# EAGLE design Master (EAGLE 9.5.0)
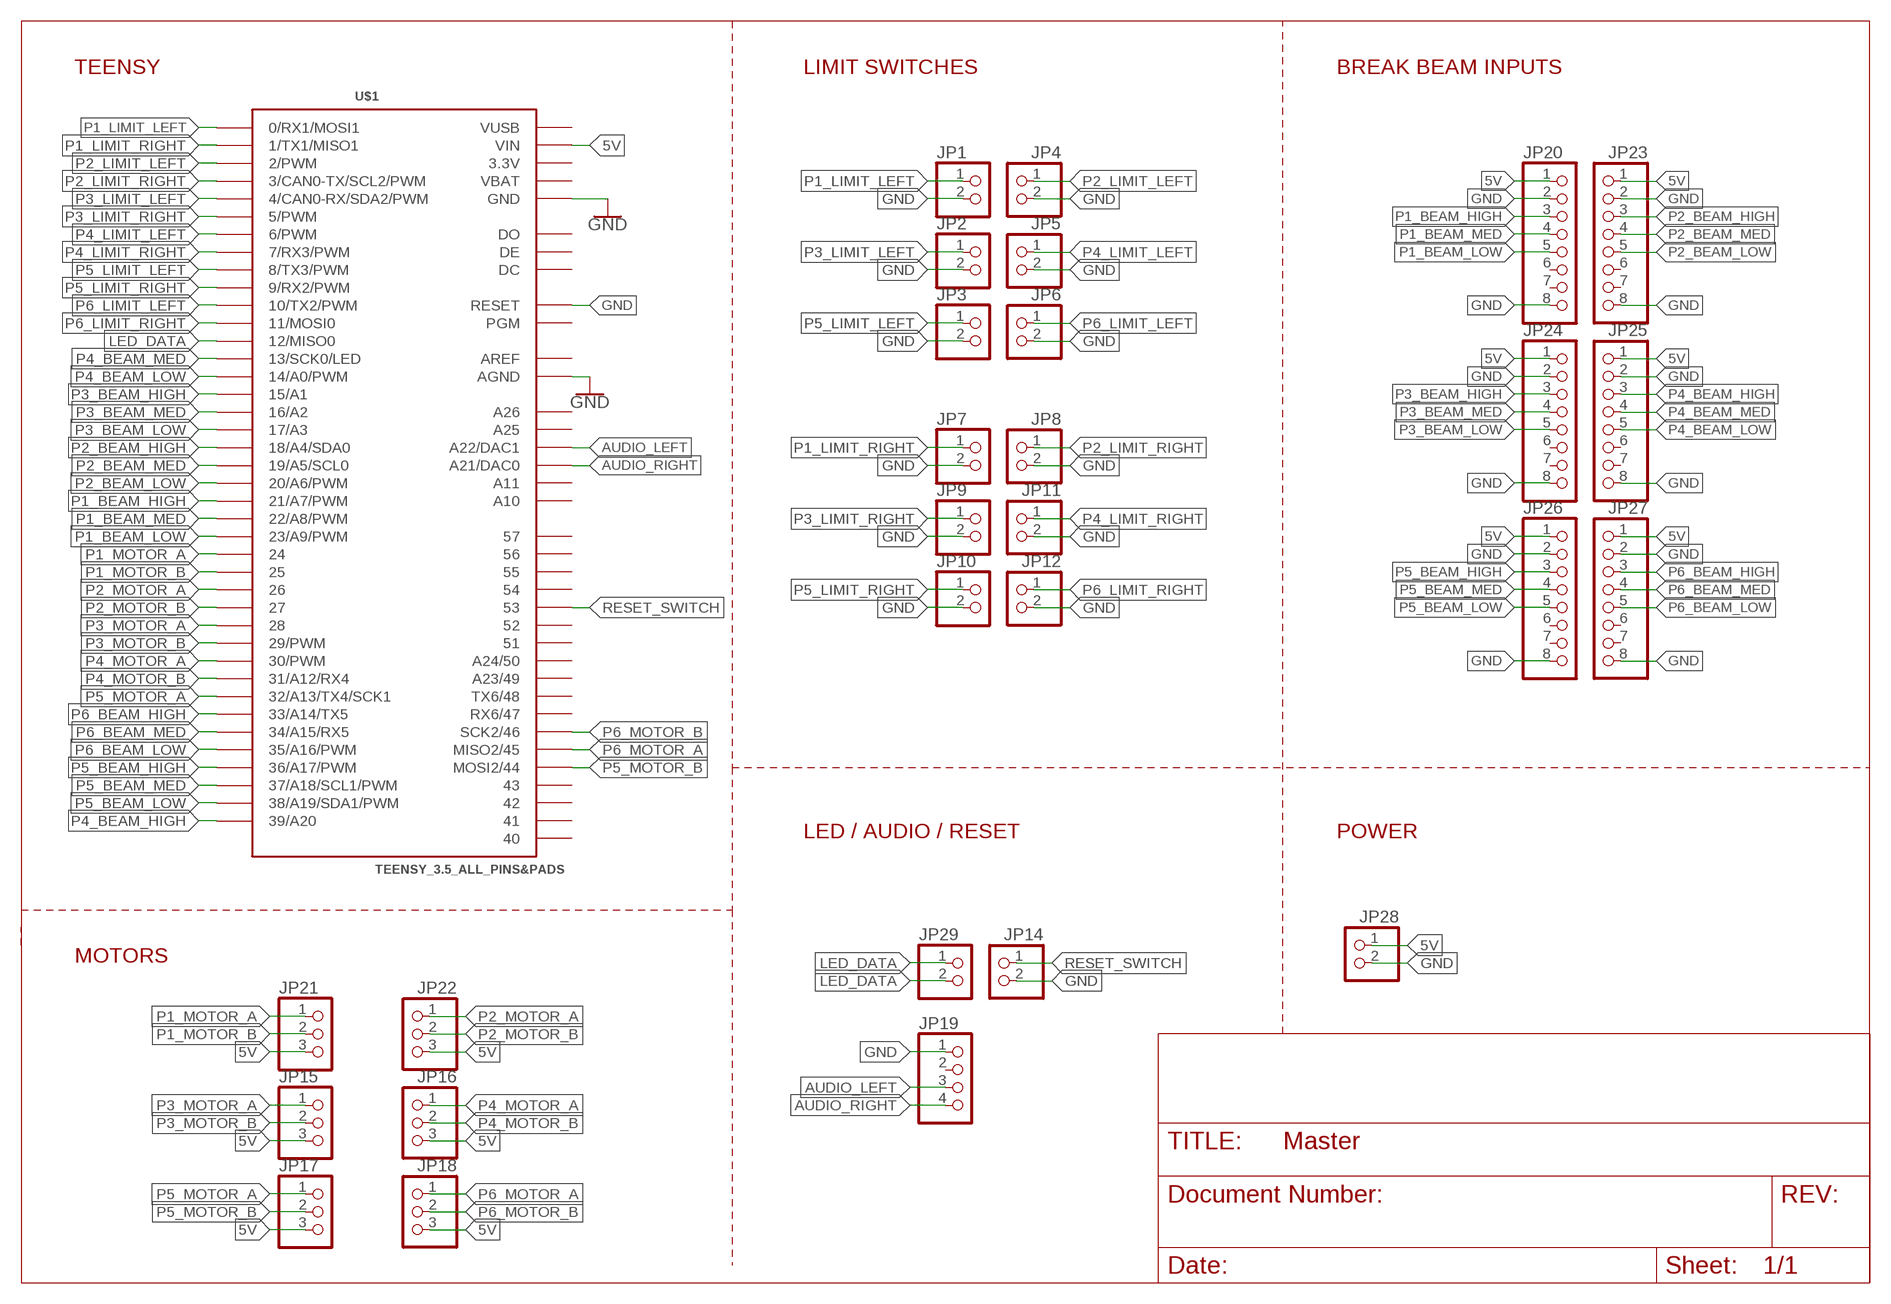
[diagram p0: schematic, sheet 1]

## Parts
JP1  PINHD-1X2  [1X02]
JP2  PINHD-1X2  [1X02]
JP3  PINHD-1X2  [1X02]
JP4  PINHD-1X2  [1X02]
JP5  PINHD-1X2  [1X02]
JP6  PINHD-1X2  [1X02]
JP7  PINHD-1X2  [1X02]
JP8  PINHD-1X2  [1X02]
JP9  PINHD-1X2  [1X02]
JP10  PINHD-1X2  [1X02]
JP11  PINHD-1X2  [1X02]
JP12  PINHD-1X2  [1X02]
JP14  PINHD-1X2  [1X02]
JP15  PINHD-1X3  [1X03]
JP16  PINHD-1X3  [1X03]
JP17  PINHD-1X3  [1X03]
JP18  PINHD-1X3  [1X03]
JP19  PINHD-1X4  [1X04]
JP20  PINHD-1X8  [1X08]
JP21  PINHD-1X3  [1X03]
JP22  PINHD-1X3  [1X03]
JP23  PINHD-1X8  [1X08]
JP24  PINHD-1X8  [1X08]
JP25  PINHD-1X8  [1X08]
JP26  PINHD-1X8  [1X08]
JP27  PINHD-1X8  [1X08]
JP28  PINHD-1X2  [1X02]
JP29  PINHD-1X2  [1X02]
U$1  TEENSY_3.5_ALL_PINS&PADS  [TEENSY_3.5_ALL_PINS&PADS]

## Nets
5V: JP15.3 JP16.3 JP17.3 JP18.3 JP20.1 JP21.3 JP22.3 JP23.1 JP24.1 JP25.1 JP26.1 JP27.1 JP28.1 U$1.VIN
AUDIO_LEFT: JP19.3 U$1.A22(A22/DAC1)
AUDIO_RIGHT: JP19.4 U$1.A21(A21/DAC0)
GND: JP1.2 JP2.2 JP3.2 JP4.2 JP5.2 JP6.2 JP7.2 JP8.2 JP9.2 JP10.2 JP11.2 JP12.2 JP14.2 JP19.1 JP20.2 JP20.8 JP23.2 JP23.8 JP24.2 JP24.8 JP25.2 JP25.8 JP26.2 JP26.8 JP27.2 JP27.8 JP28.2 U$1.AGND U$1.GND U$1.GND1(GND) U$1.GND2(GND) U$1.GND3(GND) U$1.GND4(GND) U$1.GND5(GND) U$1.GND6(GND) U$1.RESET
LED_DATA: JP29.1 JP29.2 U$1.12(12/MISO0)
P1_BEAM_HIGH: JP20.3 U$1.21/A7(21/A7/PWM)
P1_BEAM_LOW: JP20.5 U$1.23/A9(23/A9/PWM)
P1_BEAM_MED: JP20.4 U$1.22/A8(22/A8/PWM)
P1_LIMIT_LEFT: JP1.1 U$1.0(0/RX1/MOSI1)
P1_LIMIT_RIGHT: JP7.1 U$1.1(1/TX1/MISO1)
P1_MOTOR_A: JP21.1 U$1.24
P1_MOTOR_B: JP21.2 U$1.25
P2_BEAM_HIGH: JP23.3 U$1.18/A4(18/A4/SDA0)
P2_BEAM_LOW: JP23.5 U$1.20/A6(20/A6/PWM)
P2_BEAM_MED: JP23.4 U$1.19/A5(19/A5/SCL0)
P2_LIMIT_LEFT: JP4.1 U$1.2(2/PWM)
P2_LIMIT_RIGHT: JP8.1 U$1.3(3/CAN0-TX/SCL2/PWM)
P2_MOTOR_A: JP22.1 U$1.26
P2_MOTOR_B: JP22.2 U$1.27
P3_BEAM_HIGH: JP24.3 U$1.15/A1
P3_BEAM_LOW: JP24.5 U$1.17/A3
P3_BEAM_MED: JP24.4 U$1.16/A2
P3_LIMIT_LEFT: JP2.1 U$1.4(4/CAN0-RX/SDA2/PWM)
P3_LIMIT_RIGHT: JP9.1 U$1.5(5/PWM)
P3_MOTOR_A: JP15.1 U$1.28
P3_MOTOR_B: JP15.2 U$1.29(29/PWM)
P4_BEAM_HIGH: JP25.3 U$1.39/A20
P4_BEAM_LOW: JP25.5 U$1.14/A0(14/A0/PWM)
P4_BEAM_MED: JP25.4 U$1.13(13/SCK0/LED)
P4_LIMIT_LEFT: JP5.1 U$1.6(6/PWM)
P4_LIMIT_RIGHT: JP11.1 U$1.7(7/RX3/PWM)
P4_MOTOR_A: JP16.1 U$1.30(30/PWM)
P4_MOTOR_B: JP16.2 U$1.31/A12(31/A12/RX4)
P5_BEAM_HIGH: JP26.3 U$1.36/A17(36/A17/PWM)
P5_BEAM_LOW: JP26.5 U$1.38/A19(38/A19/SDA1/PWM)
P5_BEAM_MED: JP26.4 U$1.37/A18(37/A18/SCL1/PWM)
P5_LIMIT_LEFT: JP3.1 U$1.8(8/TX3/PWM)
P5_LIMIT_RIGHT: JP10.1 U$1.9(9/RX2/PWM)
P5_MOTOR_A: JP17.1 U$1.32/A13(32/A13/TX4/SCK1)
P5_MOTOR_B: JP17.2 U$1.44(MOSI2/44)
P6_BEAM_HIGH: JP27.3 U$1.33/A14(33/A14/TX5)
P6_BEAM_LOW: JP27.5 U$1.35/A16(35/A16/PWM)
P6_BEAM_MED: JP27.4 U$1.34/A15(34/A15/RX5)
P6_LIMIT_LEFT: JP6.1 U$1.10(10/TX2/PWM)
P6_LIMIT_RIGHT: JP12.1 U$1.11(11/MOSI0)
P6_MOTOR_A: JP18.1 U$1.45(MISO2/45)
P6_MOTOR_B: JP18.2 U$1.46(SCK2/46)
RESET_SWITCH: JP14.1 U$1.53
Unconnected: JP19.2 JP20.6 JP20.7 JP23.6 JP23.7 JP24.6 JP24.7 JP25.6 JP25.7 JP26.6 JP26.7 JP27.6 JP27.7 U$1.40 U$1.41 U$1.42 U$1.43 U$1.47(RX6/47) U$1.48(TX6/48) U$1.49(A23/49) U$1.50(A24/50) U$1.51 U$1.52 U$1.54 U$1.55 U$1.56 U$1.57 U$1.A10 U$1.A11 U$1.A25 U$1.A26 U$1.DC U$1.DE U$1.DO U$1.PGM

## Notes on the sheet
- TEENSY | LIMIT SWITCHES | BREAK BEAM INPUTS
- LED / AUDIO / RESET | POWER
- MOTORS

## Power pins joined to a net without a drawn wire
3.3V: U$1.3.3V U$1.3.3V2(3.3V) U$1.3.3V3(3.3V) U$1.3.3V4(3.3V)
AREF: U$1.AREF
VBAT: U$1.VBAT
VUSB: U$1.VUSB

## Library data of the parts
JP1-JP12 JP14 JP28 JP29 = pinhead:PINHD-1X2: PIN HEADER
JP15-JP18 JP21 JP22 = pinhead:PINHD-1X3: PIN HEADER
JP19 = pinhead:PINHD-1X4: PIN HEADER
JP20 JP23-JP27 = pinhead:PINHD-1X8: PIN HEADER
U$1 = Teensy_3_and_LC_Series_Boards_v1.4:TEENSY_3.5_ALL_PINS&PADS: All pins and pads on the Teensy 3.5 exposed. Assumes the use of multiple, unshrouded headers to get access to the pads on the underside of the Teensy These headers should be a 2x5, 2x4, and a 2x3 with a 0.1" hole spacing / pitch.

## Board
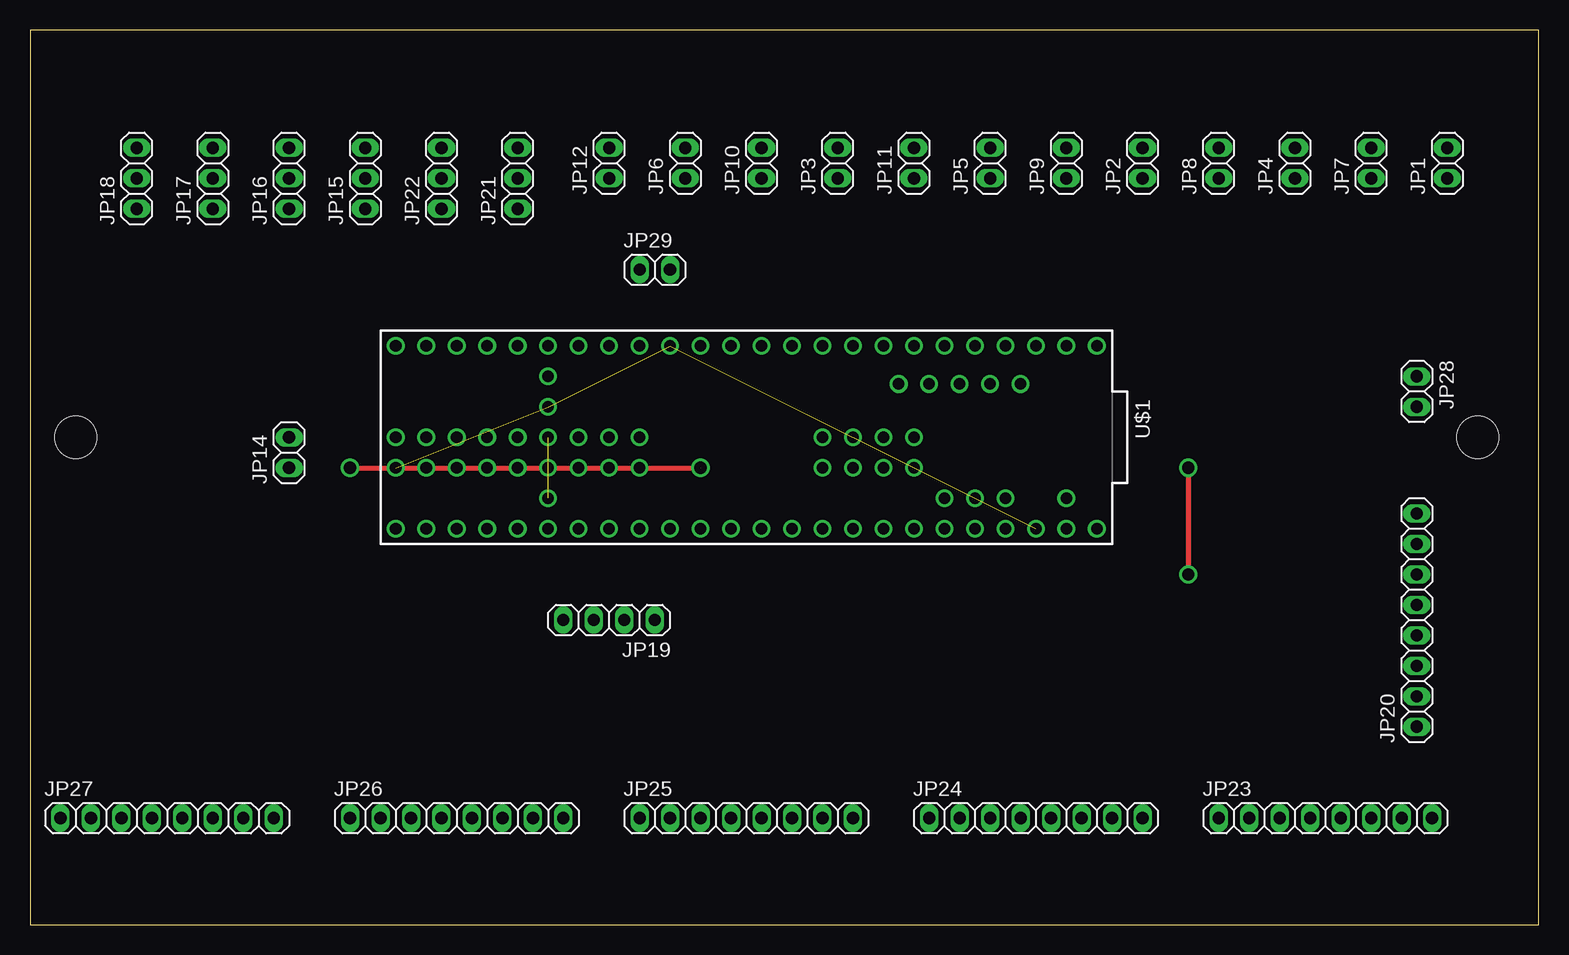
[diagram p1: board, top side]
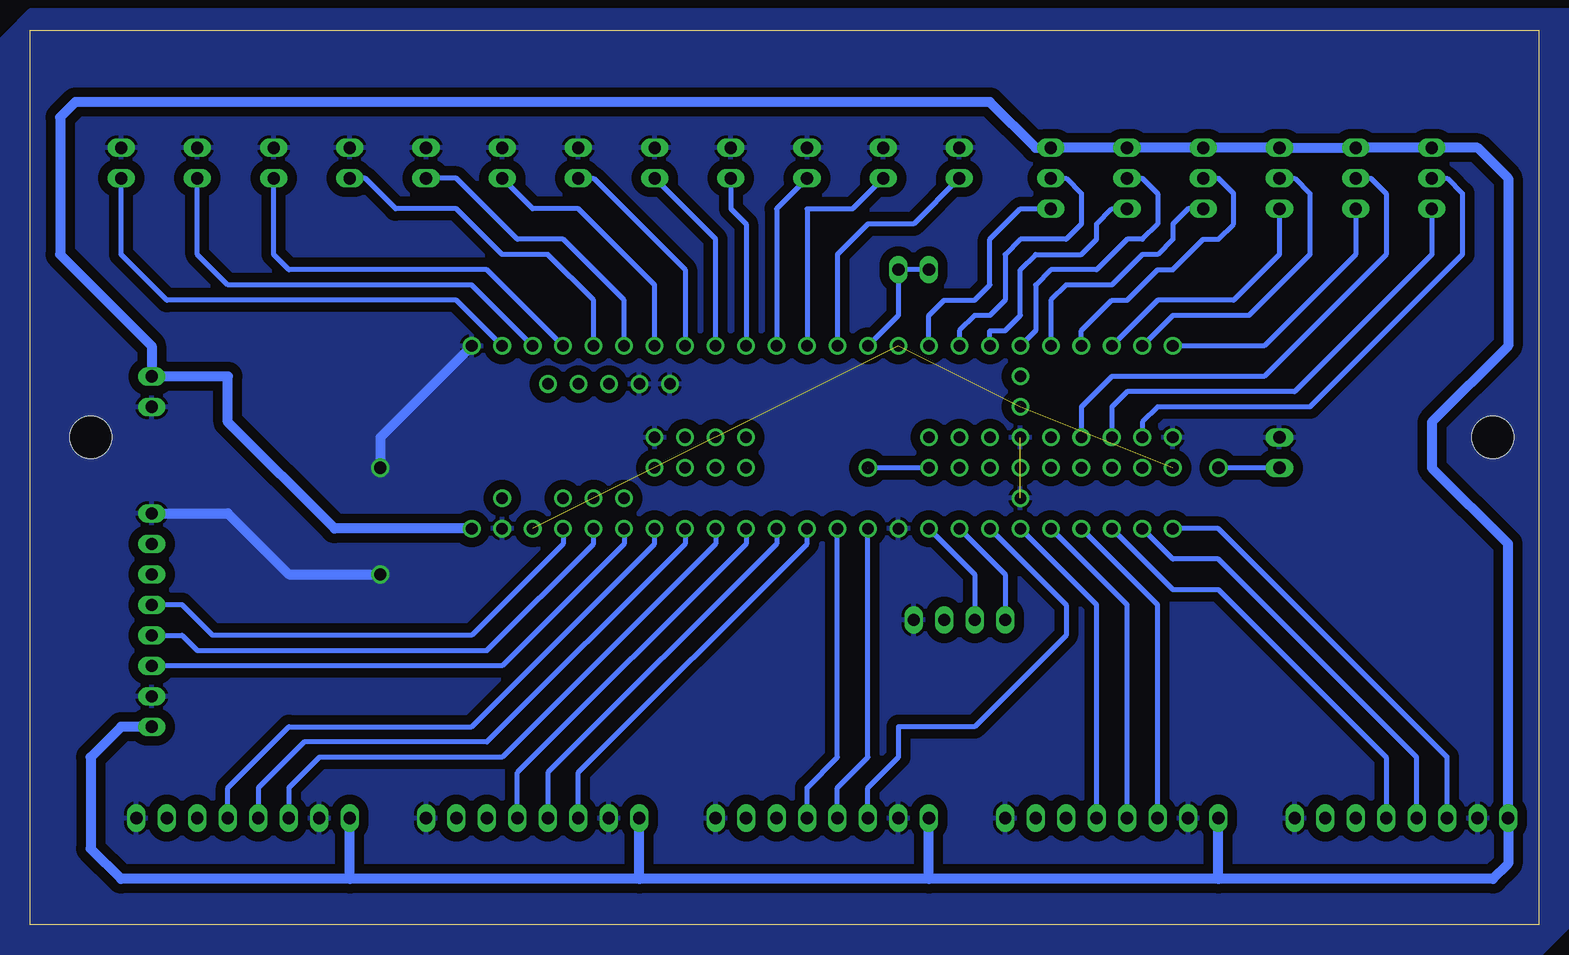
[diagram p2: board, bottom side, seen from below]

Size 125.71 x 74.6 mm. Coordinates in mm from the lower left corner, seen from the top.
Outline: 0,0 125.71,0 125.71,74.6 0,74.6 0,0
Copper layers (1*16): Top 0.035mm / dielectric 1.5mm / Bottom 0.035mm
Design rules "OthermillDRC_1_32_v2": minimum track width 8mil, minimum drill 0.8mm, track to track 0.794003125mm, track to pad 0.794003125mm, pad to pad 0.794003125mm, via to via 0.794003125mm, smd to smd 0mil, copper to edge 0mil, drill to drill 1mil, minimum pad ring 10mil, minimum via ring 10mil, stop-mask expansion 1mil, vias tented up to drill 30mil, thermal gap 10mil
Holes 3.56 mm at -25.4,64.77 116.84,80.01
Holes 3.51 mm at 3.81,40.64 120.65,40.64

### Footprints (pad centres in the part's own frame; a part is rotated, then mirrored left to right if it is on the bottom)
1X02 = drill 1.016 long: 1 -1.27,0; 2 1.27,0
1X03 = drill 1.016 long: 1 -2.54,0; 2 0,0; 3 2.54,0
1X04 = drill 1.016 long: 1 -3.81,0; 2 -1.27,0; 3 1.27,0; 4 3.81,0
1X08 = drill 1.016 long: 1 -8.89,0; 2 -6.35,0; 3 -3.81,0; 4 -1.27,0; 5 1.27,0; 6 3.81,0; 7 6.35,0; 8 8.89,0
TEENSY_3.5_ALL_PINS&PADS = drill 0.965: 0 -7.62,13.97; 1 -7.62,11.43; 2 -7.62,8.89; 3 -7.62,6.35; 3.3V 7.62,11.43; 3.3V2 2.54,-41.91; 3.3V3 -7.62,-19.05; 3.3V4 -2.54,-29.21; 4 -7.62,3.81; 5 -7.62,1.27; 6 -7.62,-1.27; 7 -7.62,-3.81; 8 -7.62,-6.35; 9 -7.62,-8.89; 10 -7.62,-11.43; 11 -7.62,-13.97; 12 -7.62,-16.51; 13 7.62,-16.51; 14/A0 7.62,-13.97; 15/A1 7.62,-11.43; 16/A2 7.62,-8.89; 17/A3 7.62,-6.35; 18/A4 7.62,-3.81; 19/A5 7.62,-1.27; 20/A6 7.62,1.27; 21/A7 7.62,3.81; 22/A8 7.62,6.35; 23/A9 7.62,8.89; 24 -7.62,-21.59; 25 -7.62,-24.13; 26 -7.62,-26.67; 27 -7.62,-29.21; 28 -7.62,-31.75; 29 -7.62,-34.29; 30 -7.62,-36.83; 31/A12 -7.62,-39.37; 32/A13 -7.62,-41.91; 33/A14 7.62,-41.91; 34/A15 7.62,-39.37; 35/A16 7.62,-36.83; 36/A17 7.62,-34.29; 37/A18 7.62,-31.75; 38/A19 7.62,-29.21; 39/A20 7.62,-26.67; 40 0,-21.59; 41 0,-24.13; 42 0,-26.67; 43 0,-31.75; 44 0,-34.29; 45 0,-36.83; 46 0,-39.37; 47 2.54,-39.37; 48 2.54,-36.83; 49 2.54,-34.29; 50 2.54,-31.75; 51 2.54,-26.67; 52 2.54,-24.13; 53 2.54,-21.59; 54 2.54,-6.35; 55 2.54,-3.81; 56 2.54,-1.27; 57 2.54,1.27; A10 5.08,6.35; A11 5.08,3.81; A21 7.62,-24.13; A22 7.62,-21.59; A25 -4.445,5.08; A26 -4.445,7.62; AGND 7.62,13.97; AREF 5.08,8.89; DC 0,-3.81; DE 0,-1.27; DO 0,-6.35; GND -7.62,16.51; GND1 7.62,-19.05; GND2 0,1.27; GND3 -4.445,2.54; GND4 -4.445,0; GND5 0,-41.91; GND6 0,-29.21; NC -4.445,10.16; PGM 2.54,-29.21; RESET 5.08,-29.21; VBAT -5.08,-29.21; VIN 7.62,16.51; VUSB 5.08,13.97

### Placement (x,y rotation side)
JP1  118.11,63.5 90 top
JP2  92.71,63.5 90 top
JP3  67.31,63.5 90 top
JP4  105.41,63.5 90 top
JP5  80.01,63.5 90 top
JP6  54.61,63.5 90 top
JP7  111.76,63.5 90 top
JP8  99.06,63.5 90 top
JP9  86.36,63.5 90 top
JP10  60.96,63.5 90 top
JP11  73.66,63.5 90 top
JP12  48.26,63.5 90 top
JP14  21.59,39.37 90 top
JP15  27.94,62.23 90 top
JP16  21.59,62.23 90 top
JP17  15.24,62.23 90 top
JP18  8.89,62.23 90 top
JP19  48.26,25.4 180 top
JP20  115.57,25.4 90 top
JP21  40.64,62.23 90 top
JP22  34.29,62.23 90 top
JP23  107.95,8.89 0 top
JP24  83.82,8.89 0 top
JP25  59.69,8.89 0 top
JP26  35.56,8.89 0 top
JP27  11.43,8.89 0 top
JP28  115.57,44.45 270 top
JP29  52.07,54.61 0 top
U$1  72.39,40.64 270 top

### Tracks (layer width: path | path; a pad name or v marks a point on that pad's centre or on a via)
3.3V  (3 unrouted)
5V
  Bottom 0.813: U$1.VIN 100.33,33.02 109.22,41.91 109.22,45.72 JP28.1 115.57,48.26 123.19,55.88 123.19,67.31 121.92,68.58 45.72,68.58 41.91,64.77 JP21.3 JP22.3 JP15.3 JP16.3 JP17.3 JP18.3 5.08,64.77 2.54,62.23 2.54,48.26 8.89,41.91 8.89,38.1 2.54,31.75 JP27.1 2.54,5.08 3.81,3.81 26.67,3.81 | 26.67,3.81 JP26.1 | 26.67,3.81 50.8,3.81 | 50.8,3.81 JP25.1 | 50.8,3.81 74.93,3.81 | 74.93,3.81 JP24.1 | 74.93,3.81 99.06,3.81 | 99.06,3.81 JP23.1 | 99.06,3.81 118.11,3.81 120.65,6.35 120.65,13.97 118.11,16.51 JP20.1
AUDIO_LEFT
  Bottom 0.406: JP19.3 46.99,29.21 U$1.A22
AUDIO_RIGHT
  Bottom 0.406: JP19.4 44.45,29.21 U$1.A21
GND  (via drill 1.02)  (1 unrouted)
  Top 0.406: v96.52,38.1 v96.52,29.21
  Bottom 0.813: U$1.GND 96.52,40.64 v96.52,38.1 | JP20.8 109.22,34.29 104.14,29.21 v96.52,29.21
  pour Bottom: -2.54,76.2 125.73,76.2 129.54,72.39 129.54,-1.27 125.73,-5.08 2.54,-5.08 -2.54,0
LED_DATA
  Bottom 0.406: JP29.1 JP29.2 53.34,50.8 U$1.12
N$2  (via drill 1.02)
  other vias: 55.88,38.1
P1_BEAM_HIGH
  Bottom 0.406: U$1.21/A7 76.2,31.75 86.36,21.59 JP20.3
P1_BEAM_LOW
  Bottom 0.406: U$1.23/A9 81.28,31.75 88.9,24.13 110.49,24.13 113.03,26.67 JP20.5
P1_BEAM_MED
  Bottom 0.406: JP20.4 113.03,24.13 111.76,22.86 87.63,22.86 78.74,31.75 U$1.22/A8
P1_LIMIT_LEFT
  Bottom 0.406: JP1.1 118.11,55.88 114.3,52.07 90.17,52.07 U$1.0
P1_LIMIT_RIGHT
  Bottom 0.406: U$1.1 88.9,53.34 109.22,53.34 111.76,55.88 JP7.1
P1_MOTOR_A
  Bottom 0.406: U$1.24 50.8,50.8 49.53,52.07 46.99,52.07 45.72,53.34 45.72,57.15 43.18,59.69 JP21.1
P1_MOTOR_B
  Bottom 0.406: JP21.2 39.37,62.23 38.1,60.96 38.1,58.42 39.37,57.15 43.18,57.15 44.45,55.88 44.45,52.07 45.72,50.8 46.99,50.8 48.26,49.53 U$1.25
P2_BEAM_HIGH
  Bottom 0.406: U$1.18/A4 68.58,31.75 86.36,13.97 101.6,13.97 104.14,11.43 JP23.3
P2_BEAM_LOW
  Bottom 0.406: JP23.5 109.22,11.43 104.14,16.51 88.9,16.51 73.66,31.75 U$1.20/A6
P2_BEAM_MED
  Bottom 0.406: U$1.19/A5 71.12,31.75 87.63,15.24 102.87,15.24 106.68,11.43 JP23.4
P2_LIMIT_LEFT
  Bottom 0.406: U$1.2 87.63,54.61 104.14,54.61 105.41,55.88 JP4.1
P2_LIMIT_RIGHT
  Bottom 0.406: U$1.3 78.74,52.07 82.55,55.88 86.36,55.88 90.17,59.69 95.25,59.69 97.79,62.23 JP8.1
P2_MOTOR_A
  Bottom 0.406: U$1.26 45.72,49.53 44.45,49.53 43.18,50.8 43.18,54.61 41.91,55.88 38.1,55.88 36.83,57.15 36.83,58.42 35.56,59.69 JP22.1
P2_MOTOR_B
  Bottom 0.406: JP22.2 33.02,62.23 31.75,60.96 31.75,58.42 33.02,57.15 34.29,57.15 36.83,54.61 40.64,54.61 41.91,53.34 41.91,49.53 U$1.27
P3_BEAM_HIGH
  Bottom 0.406: U$1.15/A1 60.96,31.75 80.01,12.7 JP24.3
P3_BEAM_LOW
  Bottom 0.406: JP24.5 85.09,12.7 66.04,31.75 U$1.17/A3
P3_BEAM_MED
  Bottom 0.406: JP24.4 82.55,12.7 63.5,31.75 U$1.16/A2
P3_LIMIT_LEFT
  Bottom 0.406: JP2.1 90.17,62.23 85.09,57.15 81.28,57.15 76.2,52.07 U$1.4
P3_LIMIT_RIGHT
  Bottom 0.406: JP9.1 83.82,59.69 80.01,59.69 73.66,53.34 U$1.5
P3_MOTOR_A
  Bottom 0.406: JP15.1 29.21,59.69 30.48,58.42 30.48,57.15 31.75,55.88 33.02,55.88 35.56,53.34 39.37,53.34 40.64,52.07 U$1.28
P3_MOTOR_B
  Bottom 0.406: JP15.2 26.67,62.23 25.4,60.96 25.4,58.42 26.67,57.15 27.94,57.15 30.48,54.61 31.75,54.61 34.29,52.07 35.56,52.07 38.1,49.53 U$1.29
P4_BEAM_HIGH
  Bottom 0.406: U$1.39/A20 39.37,26.67 39.37,24.13 46.99,16.51 53.34,16.51 53.34,13.97 55.88,11.43 JP25.3
P4_BEAM_LOW
  Bottom 0.406: JP25.5 60.96,11.43 58.42,13.97 U$1.14/A0
P4_BEAM_MED
  Bottom 0.406: JP25.4 58.42,11.43 55.88,13.97 U$1.13
P4_LIMIT_LEFT
  Bottom 0.406: JP5.1 78.74,62.23 71.12,54.61 U$1.6
P4_LIMIT_RIGHT
  Bottom 0.406: U$1.7 68.58,57.15 JP11.1
P4_MOTOR_A
  Bottom 0.406: JP16.1 21.59,55.88 25.4,52.07 31.75,52.07 U$1.30
P4_MOTOR_B
  Bottom 0.406: JP16.2 20.32,62.23 19.05,60.96 19.05,55.88 24.13,50.8 30.48,50.8 U$1.31/A12
P5_BEAM_HIGH
  Bottom 0.406: JP26.3 31.75,26.67 U$1.36/A17
P5_BEAM_LOW
  Bottom 0.406: JP26.5 36.83,26.67 U$1.38/A19
P5_BEAM_MED
  Bottom 0.406: JP26.4 34.29,26.67 U$1.37/A18
P5_LIMIT_LEFT
  Bottom 0.406: JP3.1 67.31,59.69 66.04,58.42 U$1.8
P5_LIMIT_RIGHT
  Bottom 0.406: JP10.1 63.5,59.69 U$1.9
P5_MOTOR_A
  Bottom 0.406: JP17.1 15.24,55.88 22.86,48.26 U$1.32/A13
P5_MOTOR_B
  Bottom 0.406: JP17.2 13.97,62.23 12.7,60.96 12.7,55.88 22.86,45.72 35.56,45.72 38.1,43.18 U$1.44
P6_BEAM_HIGH
  Bottom 0.406: JP27.3 7.62,13.97 26.67,33.02 U$1.33/A14
P6_BEAM_LOW
  Bottom 0.406: U$1.35/A16 30.48,27.94 26.67,27.94 12.7,13.97 JP27.5
P6_BEAM_MED
  Bottom 0.406: JP27.4 10.16,13.97 26.67,30.48 30.48,30.48 U$1.34/A15
P6_LIMIT_LEFT
  Bottom 0.406: JP6.1 57.15,59.69 60.96,59.69 U$1.10
P6_LIMIT_RIGHT
  Bottom 0.406: JP12.1 52.07,58.42 55.88,58.42 58.42,55.88 U$1.11
P6_MOTOR_A
  Bottom 0.406: JP18.1 8.89,55.88 20.32,44.45 34.29,44.45 35.56,43.18 U$1.45
P6_MOTOR_B
  Bottom 0.406: JP18.2 7.62,62.23 6.35,60.96 6.35,55.88 19.05,43.18 31.75,43.18 33.02,41.91 U$1.46
RESET_SWITCH  (via drill 1.02)  (1 unrouted)
  Top 0.406: v26.67,38.1 55.88,38.1
  Bottom 0.406: U$1.53 55.88,38.1 | JP14.1 v26.67,38.1